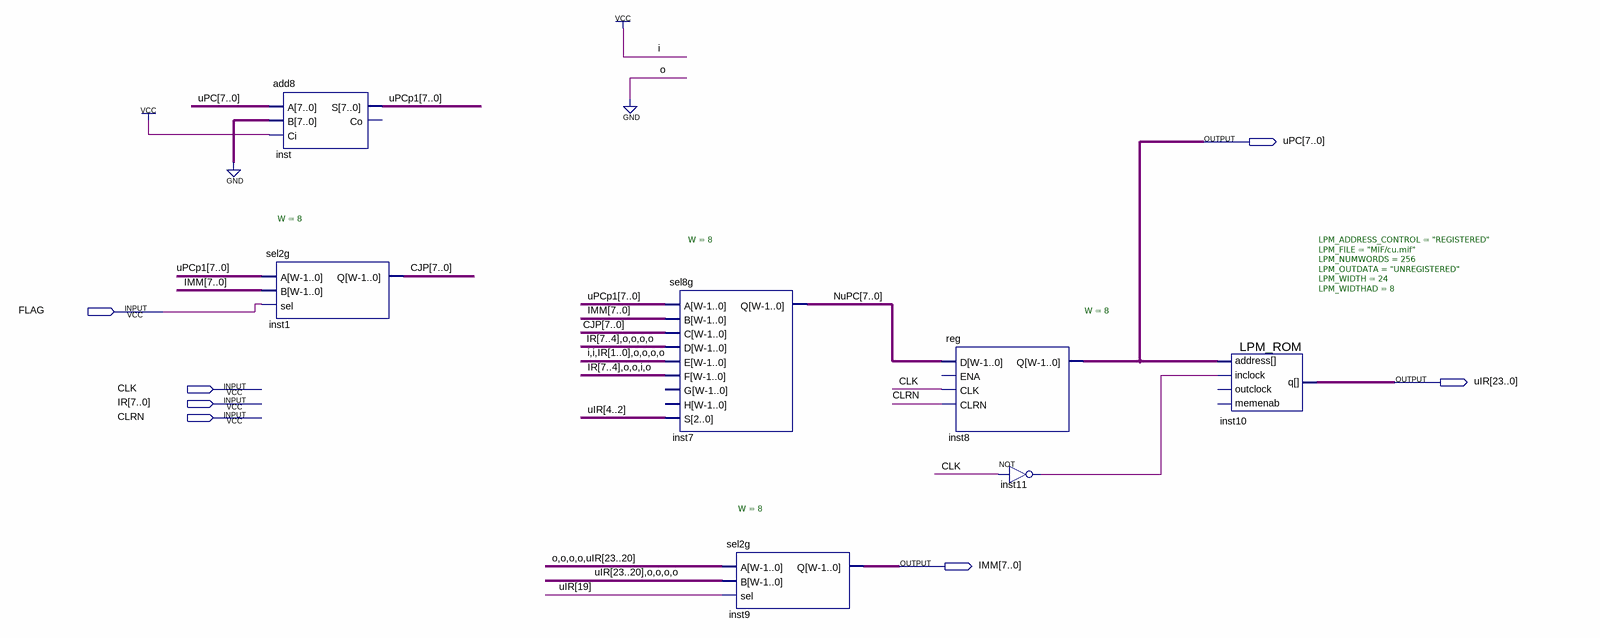
[diagram p0: schematic sheet]
// Quartus schematic cu.bdf as structural Verilog: 7 symbols, 7 pins
module cu (
  input  FLAG,
  input  CLK,
  input  [7:0] IR,
  input  CLRN,
  output [7:0] uPC,
  output [23:0] uIR,
  output [7:0] IMM
);

  wire inst11_out;
  wire [7:0] CJP, NuPC, uPCp1;

  sel2g #(.W(8)) inst1 (.A(uPCp1), .B(IMM), .sel(FLAG), .Q(CJP));
  add8 inst (.A(uPC), .B({8{1'b0}}), .Ci(1'b1), .S(uPCp1));  // open: Co
  sel8g #(.W(8)) inst7 (
    .A(uPCp1), .B(IMM), .C(CJP), .D({IR[7:4], 4'b0000}), .E({2'b11, IR[1:0], 4'b0000}),
    .F({IR[7:4], 4'b0010}), .S(uIR[4:2]), .Q(NuPC));  // open: G, H
  sel2g #(.W(8)) inst9 (.A({4'b0000, uIR[23:20]}), .B({uIR[23:20], 4'b0000}), .sel(uIR[19]), .Q(IMM));
  \reg  #(.W(8)) inst8 (.D(NuPC), .CLK(CLK), .CLRN(CLRN), .Q(uPC));  // open: ENA
  not inst11 (inst11_out, CLK);
  LPM_ROM #(.LPM_ADDRESS_CONTROL("REGISTERED"), .LPM_FILE("MIF/cu.mif"), .LPM_NUMWORDS(256), .LPM_OUTDATA("UNREGISTERED"), .LPM_WIDTH(24), .LPM_WIDTHAD(8)) inst10 (
    .address(uPC), .inclock(inst11_out), .q(uIR));  // open: outclock, memenab
endmodule
